# Altium schematic sheet JTAG20-JTAG9.SchDoc
size A4
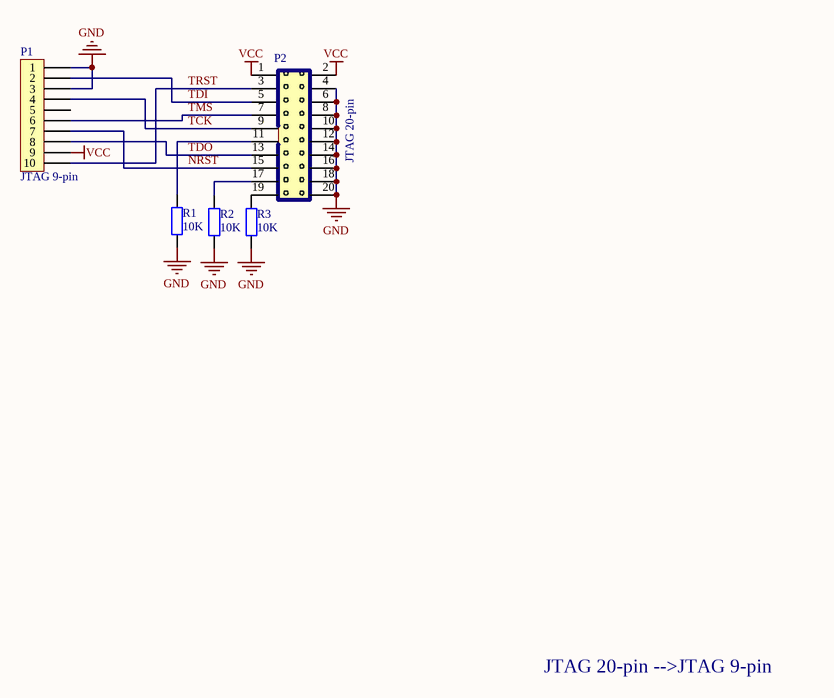
[diagram p0: JTAG20-JTAG9.SchDoc]

## Parts
P1  JTAG 9-pin  [PBD-10R]
P2  JTAG 20-pin  [IDC-20M]
R1  value 10K  [C0603]  (hidden comment: RES)
R2  value 10K  [C0603]  (hidden comment: RES)
R3  value 10K  [C0603]  (hidden comment: RES)

## Nets
GND: P1.1 P1.3 P2.4 P2.6 P2.8 P2.10 P2.12 P2.14 P2.16 P2.18 P2.20 R1.1 R2.1 R3.1
VCC: P1.9 P2.1 P2.2
NRST: P1.7 P2.15
TCK: P1.4 P2.9
TDI: P1.2 P2.5
TDO: P1.8 P2.13
TMS: P1.6 P2.7
TRST: P1.10 P2.3
NetP2_11: P2.11 R1.2
NetP2_17: P2.17 R2.2
NetP2_19: P2.19 R3.2

Not connected (* = marked no-connect by the designer): P1 5

## Notes on the sheet
- JTAG 20-pin -->JTAG 9-pin

## Library data of the parts
P1 = PBD-10R
P2 = IDC-20M
R1-R3 = RES: Resistor